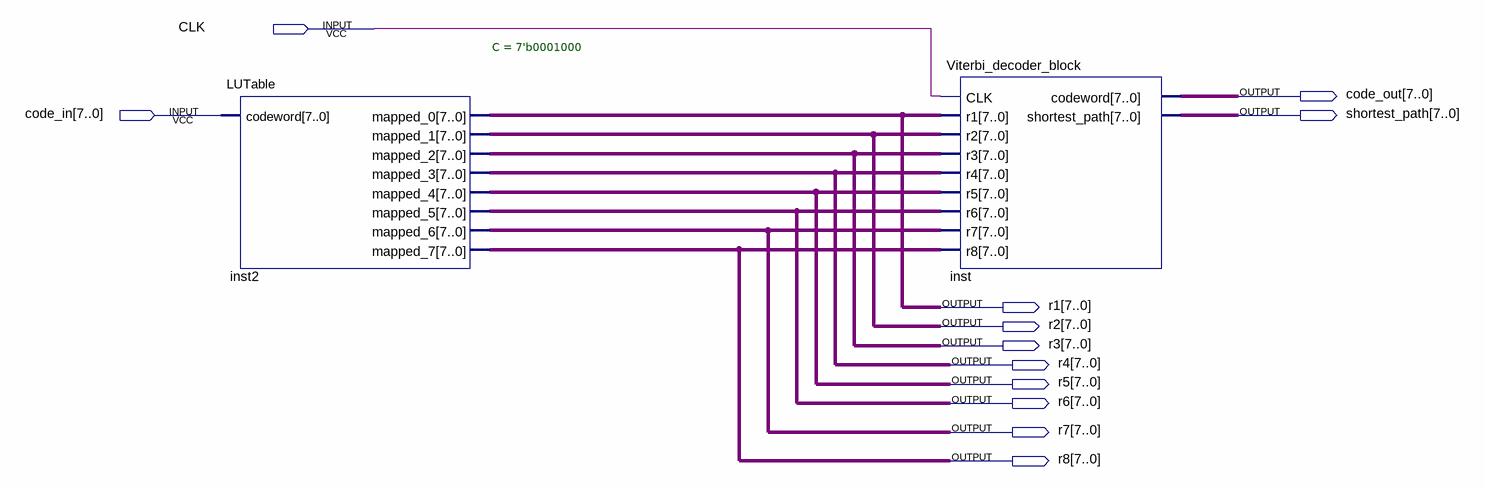
[diagram p0: schematic sheet]
// Quartus schematic test_block.bdf as structural Verilog: 2 symbols, 12 pins
module test_block (
  input  CLK,
  input  [7:0] code_in,
  output [7:0] code_out,
  output [7:0] shortest_path,
  output [7:0] r1,
  output [7:0] r2,
  output [7:0] r3,
  output [7:0] r4,
  output [7:0] r5,
  output [7:0] r6,
  output [7:0] r7,
  output [7:0] r8
);

  LUTable #(.C(7'b0001000)) inst2 (
    .codeword(code_in), .mapped_0(r1), .mapped_1(r2), .mapped_2(r3), .mapped_3(r4), .mapped_4(r5),
    .mapped_5(r6), .mapped_6(r7), .mapped_7(r8));
  Viterbi_decoder_block inst (
    .CLK(CLK), .r1(r1), .r2(r2), .r3(r3), .r4(r4), .r5(r5), .r6(r6), .r7(r7), .r8(r8), .codeword(code_out),
    .shortest_path(shortest_path));
endmodule
